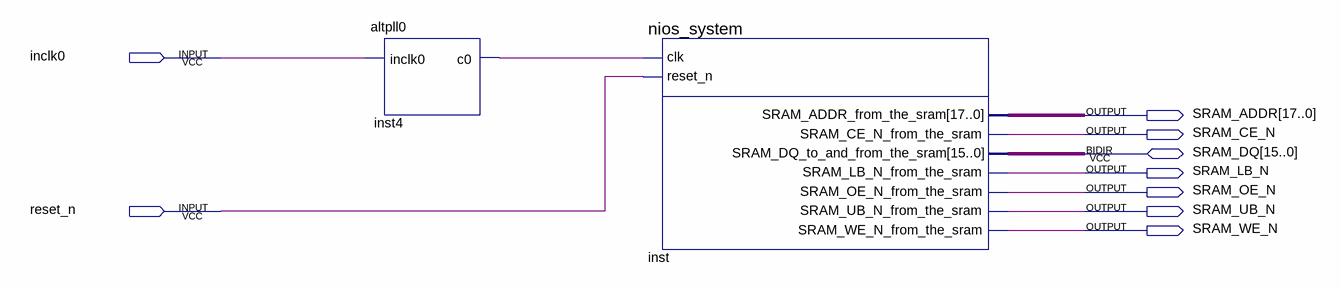
[diagram p0: schematic sheet]
// Quartus schematic Drystone.bdf as structural Verilog: 2 symbols, 9 pins
module Drystone (
  input  inclk0,
  input  reset_n,
  inout  [15:0] SRAM_DQ,
  output [17:0] SRAM_ADDR,
  output SRAM_CE_N,
  output SRAM_LB_N,
  output SRAM_OE_N,
  output SRAM_UB_N,
  output SRAM_WE_N
);

  wire inst4_c0;

  altpll0 inst4 (.inclk0(inclk0), .c0(inst4_c0));
  nios_system inst (
    .clk(inst4_c0), .reset_n(reset_n), .SRAM_ADDR_from_the_sram(SRAM_ADDR),
    .SRAM_CE_N_from_the_sram(SRAM_CE_N), .SRAM_LB_N_from_the_sram(SRAM_LB_N),
    .SRAM_OE_N_from_the_sram(SRAM_OE_N), .SRAM_UB_N_from_the_sram(SRAM_UB_N),
    .SRAM_WE_N_from_the_sram(SRAM_WE_N), .SRAM_DQ_to_and_from_the_sram(SRAM_DQ));
endmodule
